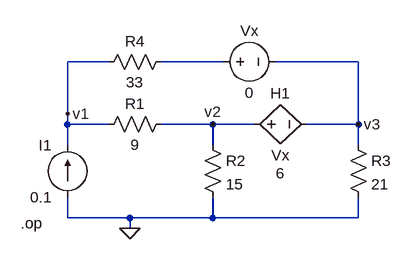
[diagram p0: schematic nodal11.asc]
nodal11.asc, the LTspice schematic file:
Version 4
SHEET 1 880 680
WIRE 16 16 -48 16
WIRE 192 16 96 16
WIRE 400 16 272 16
WIRE -48 96 -48 16
WIRE -48 112 -48 96
WIRE 16 112 -48 112
WIRE 176 112 96 112
WIRE 240 112 176 112
WIRE 400 112 400 16
WIRE 400 112 320 112
WIRE -48 144 -48 112
WIRE 176 144 176 112
WIRE 400 144 400 112
WIRE -48 256 -48 224
WIRE 48 256 -48 256
WIRE 176 256 176 224
WIRE 176 256 48 256
WIRE 400 256 400 224
WIRE 400 256 176 256
WIRE 48 272 48 256
FLAG 48 272 0
FLAG -48 96 v1
FLAG 176 112 v2
FLAG 400 112 v3
DATAFLAG -48 96 ""
DATAFLAG 400 96 ""
DATAFLAG 160 112 ""
SYMBOL res 112 96 R90
WINDOW 0 0 56 VBottom 2
WINDOW 3 32 56 VTop 2
SYMATTR InstName R1
SYMATTR Value 9
SYMBOL res 112 0 R90
WINDOW 0 0 56 VBottom 2
WINDOW 3 32 56 VTop 2
SYMATTR InstName R4
SYMATTR Value 33
SYMBOL res 160 128 R0
SYMATTR InstName R2
SYMATTR Value 15
SYMBOL res 384 128 R0
SYMATTR InstName R3
SYMATTR Value 21
SYMBOL current -48 224 R180
WINDOW 0 24 80 Left 2
WINDOW 3 24 0 Left 2
WINDOW 123 0 0 Left 0
WINDOW 39 0 0 Left 0
SYMATTR InstName I1
SYMATTR Value 0.1
SYMBOL h 224 112 R270
WINDOW 0 32 56 VTop 2
WINDOW 3 -32 56 VBottom 2
WINDOW 123 -60 56 VBottom 2
SYMATTR InstName H1
SYMATTR Value Vx
SYMATTR Value2 6
SYMBOL voltage 176 16 R270
WINDOW 0 32 56 VTop 2
WINDOW 3 -32 56 VBottom 2
WINDOW 123 0 0 Left 0
WINDOW 39 0 0 Left 0
SYMATTR InstName Vx
SYMATTR Value 0
TEXT -120 264 Left 2 !.op

The netlist it stands for:
* nodal11.asc
R1 v2 v1 9
R4 N001 v1 33
R2 v2 0 15
R3 v3 0 21
I1 0 v1 0.1
H1 v2 v3 Vx 6
Vx N001 v3 0
.op
.backanno
.end